# Altium schematic sheet Charger.SchDoc
size A4; SheetNumber: 1; SheetTotal: 1
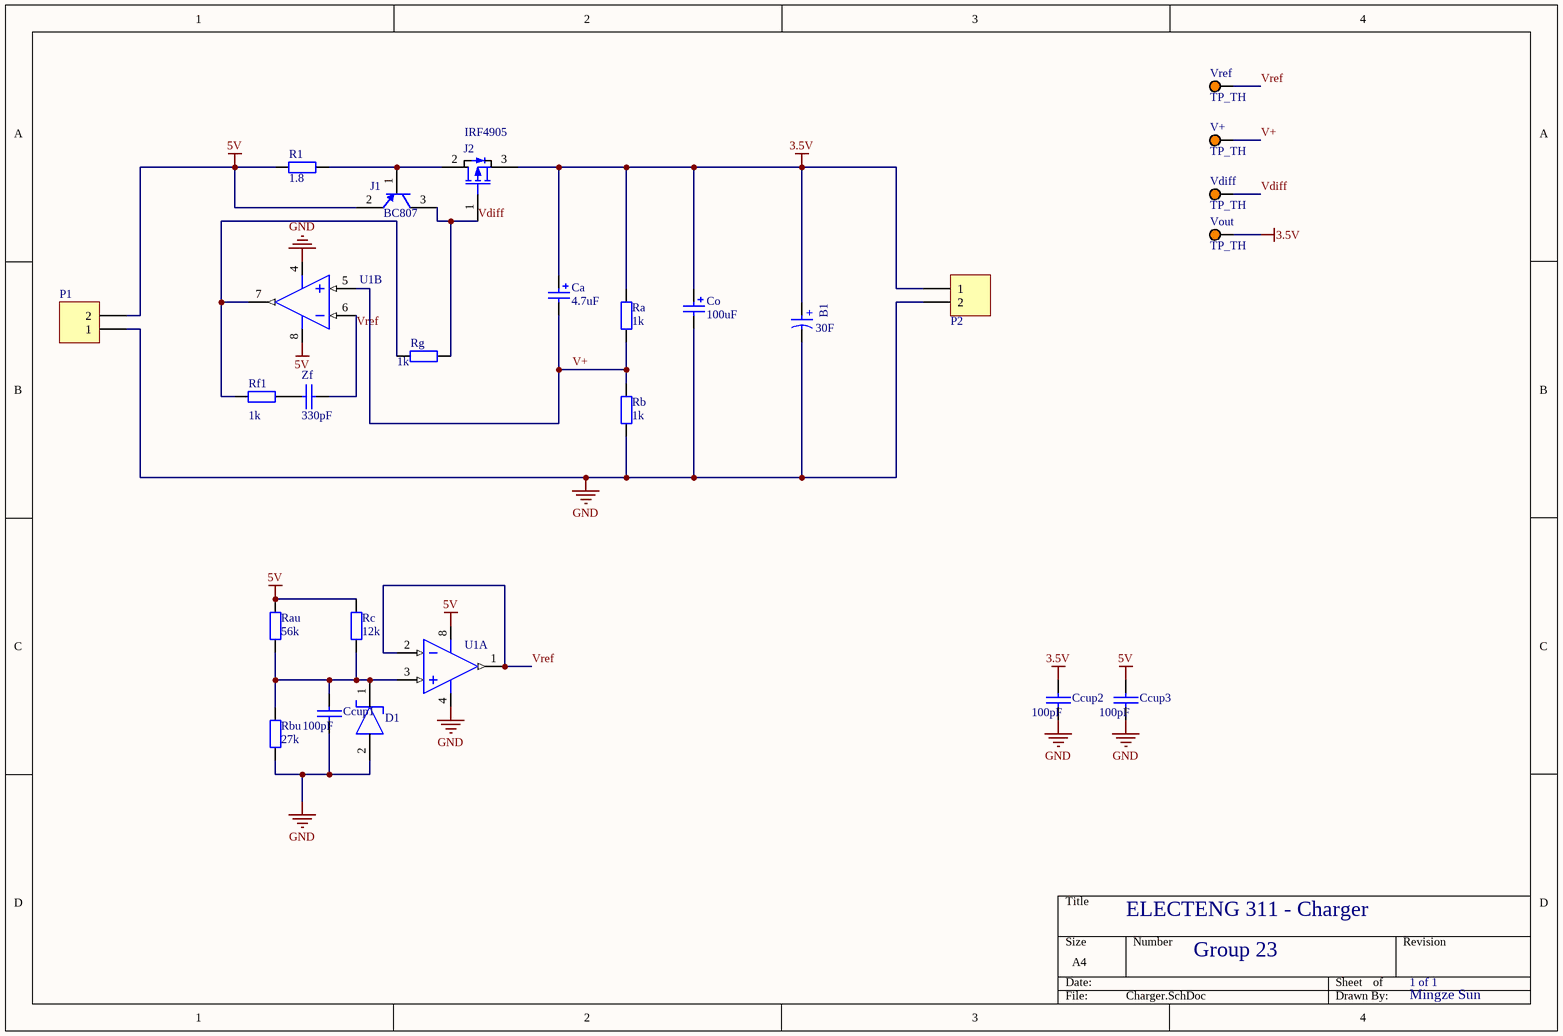
[diagram p0: Charger.SchDoc]

## Parts
B1  Capacitance: 30F  [WCAP-ATG5_D8H11.5]  (hidden comment: 860020474014)
Ca  value 4.7uF  [ECE-CAPAE4X5.4SM]  (hidden comment: CAP000302)
Ccup1  value 100pF  [ECE-CAPC1608-0603SM]  (hidden comment: CAP000606)
Ccup2  value 100pF  [ECE-CAPC1608-0603SM]  (hidden comment: CAP000606)
Ccup3  value 100pF  [ECE-CAPC1608-0603SM]  (hidden comment: CAP000606)
Co  value 100uF  [ECE-CAPAE6.3X5.4SM]  (hidden comment: CAP000306)
D1  SZESD8351XV2T1G  [FP-502-MFG]  (value not drawn)
J1  BC807  [ECE-SOT23SM]
J2  value IRF4905  [ECE-TO220ABTH]  (hidden comment: TRA000017)
P1  CON000001  [ECE-600102STTH]  (value not drawn)
P2  CON000001  [ECE-600102STTH]  (value not drawn)
R1  1.8  [ECE-RESA0.4TH]
Ra  value 1k  [ECE-RESC1608-0603SM]  (hidden comment: RES000138)
Rau  value 56k  [ECE-RESC1608-0603SM]  (hidden comment: RES000159)
Rb  value 1k  [ECE-RESC1608-0603SM]  (hidden comment: RES000138)
Rbu  value 27k  [ECE-RESC1608-0603SM]  (hidden comment: RES000155)
Rc  12k  [ECE-RESC1608-0603SM]
Rf1  value 1k  [ECE-RESC1608-0603SM]  (hidden comment: RES000138)
Rg  value 1k  [ECE-RESC1608-0603SM]  (hidden comment: RES000138)
U1  TLV9162IDR  [SOIC8-Ti-Footprint]  (value not drawn)  (parts A,B of 2)
V+  TP_TH  [Test-Pin-TH]
Vdiff  TP_TH  [Test-Pin-TH]
Vout  TP_TH  [Test-Pin-TH]
Vref  TP_TH  [Test-Pin-TH]
Zf  value 330pF  [ECE-CAPC1608-0603SM]  (hidden comment: CAP000609)

## Nets
3.5V: B1.1(P) Ca.1 Ccup2.1 Co.1 J2.3(S) P2.1 Ra.1 Vout.1
5V: Ccup3.1 J1.2(E) P1.2 R1.1 Rau.1 Rc.2 U1.8(VCC)
GND: B1.2(N) Ccup1.2 Ccup2.2 Ccup3.2 Co.2 D1.2(A) P1.1 P2.2 Rb.2 Rbu.2 U1.4(GND)
V+: Ca.2 Ra.2 Rb.1 U1.5(2IN+) V+.1
Vdiff: J1.3(C) J2.1(G) Rg.2 Vdiff.1
Vref: U1.1(1OUT) U1.2(1IN-) U1.6(2IN-) Vref.1 Zf.1
NetCcup1_1: Ccup1.1 D1.1(C) Rau.2 Rbu.1 Rc.1 U1.3(1IN+)
NetJ1_1: J1.1(B) J2.2(D) R1.2
NetRf1_1: Rf1.1 Rg.1 U1.7(2OUT)
NetRf1_2: Rf1.2 Zf.2

## Notes on the sheet
- ELECTENG 311 - Charger
- Group 23
- 1 of 1
- Mingze Sun
- (in symbol CMP-03913-53914196-2) +

## Library data of the parts
B1 = CMP-03913-53914196-2: Alum. Electrolytic Cap 470UF 25V 8MM Radial WCAP-ATG5, Lifetime 2000H +105OC; Tolerance: 20%; Pitch: 3.5mm; Leakage Current: 117.5µA; Life (Hours): 2000hours; Ripple Current: 410mA; REACH SVHC: Unknown; Length: 11.5mm; Lead Pitch: 3.5mm; Max Operating Temperature: 105°C; Height: 11.5mm; Min Operating Temperature: -40°C; Diameter: 8mm; Voltage Rating (DC): 25V; Voltage Rating: 25V; Case/Package: Radial
Ca = CMP-039-000108-1: CAP 4.7uF 35V ELE SM; Manufacturer-PN: UWX1V4R7MCL1GB; Manufactuer: Nichicon; Item Type: Item; Assembly Method: Surface Mount; Path: ece/ts/Lists/Stock Inventory; Supplier1-PN: 493-2116-2-ND; Supplier1: Digikey; Size/Package: 4 X 5.4; Component Type: CAP-4X5.4-4.7uF-35V; UoA Stock#: CAP000302; Status: Active; Voltage/Current: 35V; Category: Capacitor; Datasheet Link: http://share.engineering.auckland.ac.nz/ece/ts/Student%20Documents/SMT-Ecaps-e-wx.pdf
Ccup1-Ccup3 = CMP-039-000149-1: CAP CER 100pF 50V NPO SM0603; Manufactuer: Samsung; Manufacturer-PN: CL10C101KB8NNNC; Path: ece/ts/Lists/Stock Inventory; Item Type: Item; Assembly Method: Surface Mount; Supplier1: Digikey; Component Type: CAP-0603-100pF; Supplier1-PN: 1276-2167-2-ND; Status: Active; Size/Package: 0603 (1608 Metric); Category: Capacitor; Voltage/Current: 50V; UoA Stock#: CAP000606
Co = CMP-039-000112-1: CAP 100uF 16V ELE SM; Manufactuer: Nichicon; Manufacturer-PN: UWX1C101MCL1GB; Item Type: Item; Assembly Method: Surface Mount; Path: ece/ts/Lists/Stock Inventory; UoA Stock#: CAP000306; Datasheet Link: http://share.engineering.auckland.ac.nz/ece/ts/Student%20Documents/SMT-Ecaps-e-wx.pdf; Voltage/Current: 16V; Category: Capacitor; Status: Active; Size/Package: 6.3 X 5.4; Supplier1-PN: 493-2105-2-ND; Supplier1: Digikey; Component Type: CAP-6.3X5.4-100uF-16V
D1 = CMP-00278-47358907-1: SZESD8351XV2T1G SZESD8351 Series 11.2 V 5 A Surface Mount ESD Protection Diode - SOD-523; Manufacturer Lifecycle Status: ACTIVE; Min Breakdown Voltage: 5.5V; Capacitance: 400fF; Reverse Standoff Voltage: 3.3V; Number of Channels: 1; Clamping Voltage: 8.2V; Direction: Unidirectional; Max Junction Temperature (Tj): 125°C; Power Line Protection: No; Peak Pulse Current: 5A; Element Configuration: Single; Number of Unidirectional Channels: 1; RoHS: Compliant; Working Voltage: 3.3V; NexarPartId: 47358907; Mount: Surface Mount; Lifecycle Status: Production; Max Operating Temperature: 125°C; Height: 700µm; Case/Package: SOD; Composition: Zener; Number of Pins: 2; Min Operating Temperature: -55°C; Lead Free: Lead Free; Breakdown Voltage: 5.5V; Packaging: Tape & Reel (TR)
J1 = CMP-053-000000-1: TRANS PNP GP 500MA 45V SOT23; Manufacturer-PN: BC807-40,215; Manufactuer: NXP Semiconductors; Path: ece/ts/Lists/Stock Inventory; UoA Stock#: TRA000025; Voltage/Current: 45V/500mA; Assembly Method: Surface Mount; Value: BC807-40,215; Item Type: Item; Category: Transistor; Supplier1-PN: 568-1629-2-ND; Supplier1: Digikey; Status: Active; Component Type: TRA-SOT23-BC807; Datasheet Link: http://share.engineering.auckland.ac.nz/ece/ts/Student%20Documents/BC807_BC807W_BC327.pdf; Size/Package: SOT23
J2 = CMP-054-000016-1: P-Type MOSFET IRF4905 TH; Manufacturer-PN: IRF4905PBF; Manufactuer: International Rectifier; Voltage/Current: 55V/74A; Assembly Method: Through hole; Path: ece/ts/Lists/Stock Inventory; Item Type: Item; Datasheet Link: http://share.engineering.auckland.ac.nz/ece/ts/Student%20Documents/IRF4905_MOSFET.pdf; Supplier2-PN: 1298510; Supplier1-PN: IRF4905; Category: Transistor; Component Type: NA; UoA Stock#: TRA000017; Supplier2: Element 14; Size/Package: TO220AB; Supplier1: Arrow Components; Status: Active
P1 P2 = CMP-040-000000-1: HEADER POLARISED 2WAY TH; Manufacturer-PN: 600102ST; Manufactuer: GTK; Path: ece/ts/Lists/Stock Inventory; Assembly Method: Through hole; Item Type: Item; Supplier2: Active Components; Status: Active; Category: Connector; Supplier2-PN: 600102ST; Supplier1: Elecon; Size/Package: 2.54 Radial; UoA Stock#: CON000001; Datasheet Link: http://share.engineering.auckland.ac.nz/ece/ts/Student%20Documents/polarised_connectors.pdf; Supplier1-PN: YY3N02; Component Type: NA; Value: 2 Way
R1 = CMP-052-000003-1: RES MF 1R8 TH; Assembly Method: Through hole; UoA Stock#: RES000004; Path: ece/ts/Lists/Stock Inventory; Voltage/Current: 0.6W; Item Type: Item; Component Type: NA; Value: 1.8; Status: Active; Supplier1: Active components; Supplier1-PN: T462164; Size/Package: Axial 10mm; Category: Resistor
Ra Rb Rf1 Rg = CMP-052-000122-1: RES CER 1K 1608 SM; Manufacturer-PN: ERJ-3EKF1001V; Manufactuer: Panasonic; Voltage/Current: 1/10W; Path: ece/ts/Lists/Stock Inventory; Item Type: Item; Assembly Method: Surface Mount; Status: Active; Datasheet Link: http://share.engineering.auckland.ac.nz/ece/ts/Student%20Documents/Panasonic-Resistors.pdf; Supplier1-PN: P1.00KHTR-ND; Supplier1: Digikey; UoA Stock#: RES000138; Category: Resistor; Size/Package: 1608 (0603); Component Type: RES-1608-1K
Rau = CMP-052-000143-1: RES CER 56K 1608 SM; Manufacturer-PN: ERJ-3EKF5602V; Manufactuer: Panasonic; Voltage/Current: 1/10W; Path: ece/ts/Lists/Stock Inventory; Assembly Method: Surface Mount; Item Type: Item; Status: Active; Datasheet Link: http://share.engineering.auckland.ac.nz/ece/ts/Student%20Documents/Panasonic-Resistors.pdf; UoA Stock#: RES000159; Supplier1: Digikey; Supplier1-PN: P56.0KHTR-ND; Category: Resistor; Component Type: RES-1608-56K; Size/Package: 1608 (0603)
Rbu = CMP-052-000139-1: RES CER 27K 1608 SM; Manufactuer: Samsung; Manufacturer-PN: RC1608F273CS; Item Type: Item; Voltage/Current: 1/10W; Assembly Method: Surface Mount; Path: ece/ts/Lists/Stock Inventory; Supplier1: Digikey; Component Type: RES-1608-27K; Datasheet Link: http://share.engineering.auckland.ac.nz/ece/ts/Student%20Documents/Samsung-CHIP_RESISTOR_150112_1.pdf; Supplier1-PN: 1276-4781-2-ND; UoA Stock#: RES000155; Category: Resistor; Status: Active; Size/Package: 1608 (0603)
Rc = CMP-052-000135-1: RES CER 12K 1608 SM; Manufacturer-PN: MCR03ERTF1202; Manufactuer: Rohm; Voltage/Current: 1/10W; Assembly Method: Surface Mount; UoA Stock#: RES000151; Item Type: Item; Path: ece/ts/Lists/Stock Inventory; Component Type: RES-1608-12K; Supplier1-PN: RHM12.0KCLTR-ND; Category: Resistor; Supplier1: Digikey; Value: 12k; Status: Active; Datasheet Link: http://share.engineering.auckland.ac.nz/ece/ts/Student%20Documents/Rohm-resistors.pdf; Size/Package: 1608 (0603)
U1 = CMP-001-0004-1: Dual 10pA 33V/us 11MHz SOIC-8 Operational Amplifier ROHS; Case/Package: SOIC
V+ Vdiff Vout Vref = CMP-00024-1: Test pin TH generic
Zf = CMP-039-000152-1: CAP CER 330pF 50V X7R SM0603; Manufacturer-PN: CC0603KRX7R9BB331; Manufactuer: Yageo; Path: ece/ts/Lists/Stock Inventory; Item Type: Item; Assembly Method: Surface Mount; UoA Stock#: CAP000609; Category: Capacitor; Status: Active; Size/Package: 0603 (1608 Metric); Supplier1: Digikey; Supplier1-PN: 311-1186-2-ND; Component Type: CAP-0603-330pF; Voltage/Current: 50V